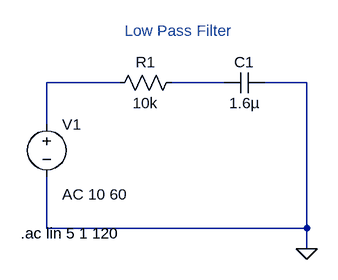
[diagram p0: schematic Low_Pass_Filter.asc]
Low_Pass_Filter.asc, the LTspice schematic file:
Version 4.1
SHEET 1 880 680
WIRE 160 64 48 64
WIRE 320 64 240 64
WIRE 448 64 384 64
WIRE 48 128 48 64
WIRE 48 288 48 208
WIRE 448 288 448 64
WIRE 448 288 48 288
WIRE 448 320 448 288
FLAG 448 320 0
SYMBOL voltage 48 112 R0
WINDOW 123 24 124 Left 2
WINDOW 39 0 0 Left 0
SYMATTR InstName V1
SYMATTR Value ""
SYMATTR Value2 AC 10 60
SYMBOL res 256 48 R90
WINDOW 0 0 56 VBottom 2
WINDOW 3 32 56 VTop 2
SYMATTR InstName R1
SYMATTR Value 10k
SYMBOL cap 384 48 R90
WINDOW 0 0 32 VBottom 2
WINDOW 3 32 32 VTop 2
SYMATTR InstName C1
SYMATTR Value 1.6µ
TEXT 8 296 Left 2 !.ac lin 5 1 120
TEXT 168 -16 Left 2 ;Low Pass Filter

The netlist it stands for:
* Low_Pass_Filter.asc
V1 N001 0 AC 10 60
R1 N002 N001 10k
C1 0 N002 1.6µ
.ac lin 5 1 120
* Low Pass Filter
.backanno
.end